# EAGLE design DPSD (EAGLE 9.6.2)
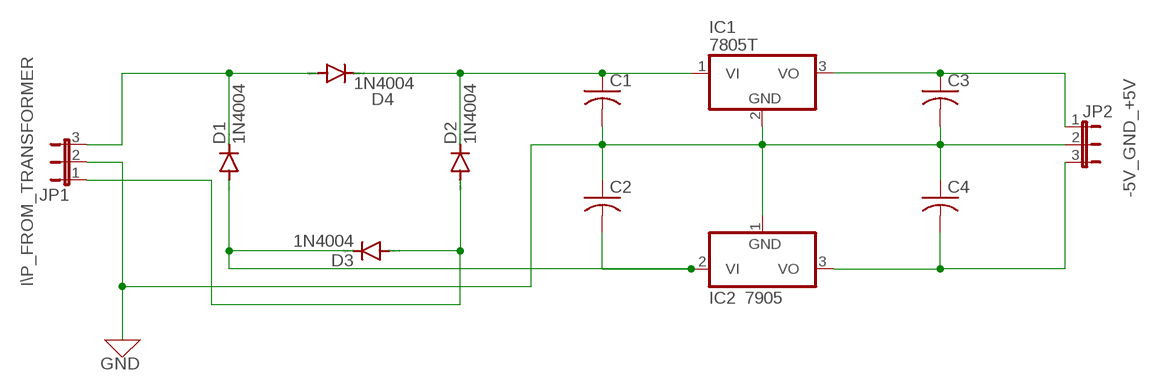
[diagram p0: schematic, sheet 1]

## Parts
C1  C-US025-024X044  [C025-024X044]
C2  C-US025-024X044  [C025-024X044]
C3  C-US025-024X044  [C025-024X044]
C4  C-US025-024X044  [C025-024X044]
D1  1N4004  [DO41-10]
D2  1N4004  [DO41-10]
D3  1N4004  [DO41-10]
D4  1N4004  [DO41-10]
IC1  7805T  [TO220H]
IC2  7905T  [TO220H]
JP1  JP2E  [JP2]
JP2  JP2E  [JP2]

## Nets
0: C1.2 C2.1 IC1.2(GND) IC2.1(GND) JP1.2 JP2.2 ; supply symbol labelled GND
N$1: D1.C D4.A JP1.3
N$2: C1.1 D2.C D4.C IC1.1(VI)
N$3: D2.A D3.A JP1.1
N$5: C3.2 C4.1
N$8: C3.1 IC1.3(VO) JP2.1
N$9: C4.2 IC2.3(VO) JP2.3
N$11: C2.2 D1.A D3.C IC2.2(VI)

## Notes on the sheet
- -5V_GND_+5V
- I\P_FROM_TRANSFORMER
- 7905
- GND

## Library data of the parts
C1-C4 = rcl:C-US: CAPACITOR, American symbol; SPICEPREFIX: C
D1-D4 = diode:1N4004: DIODE general purpose rectifier, 1 A
IC1 = linear:78*: Positive VOLTAGE REGULATOR Source: http://cache.national.com/ds/LM/LM78L05.pdf http://www.fairchildsemi.com/ds/LM/LM7805.pdf
IC2 = linear:79*: Negative VOLTAGE REGULATOR
JP1 JP2 = jumper:JP2E: JUMPER

## Board
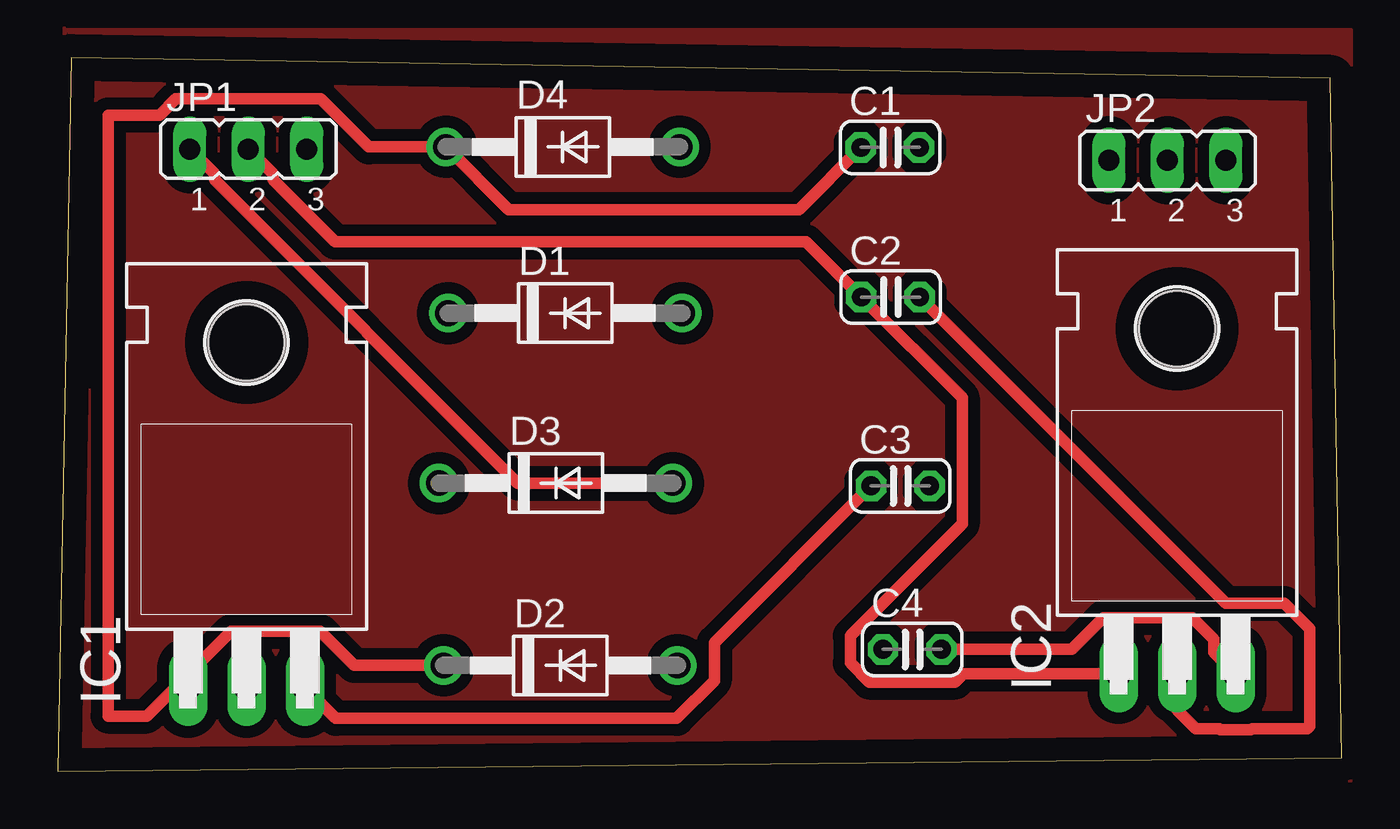
[diagram p1: board, top side]
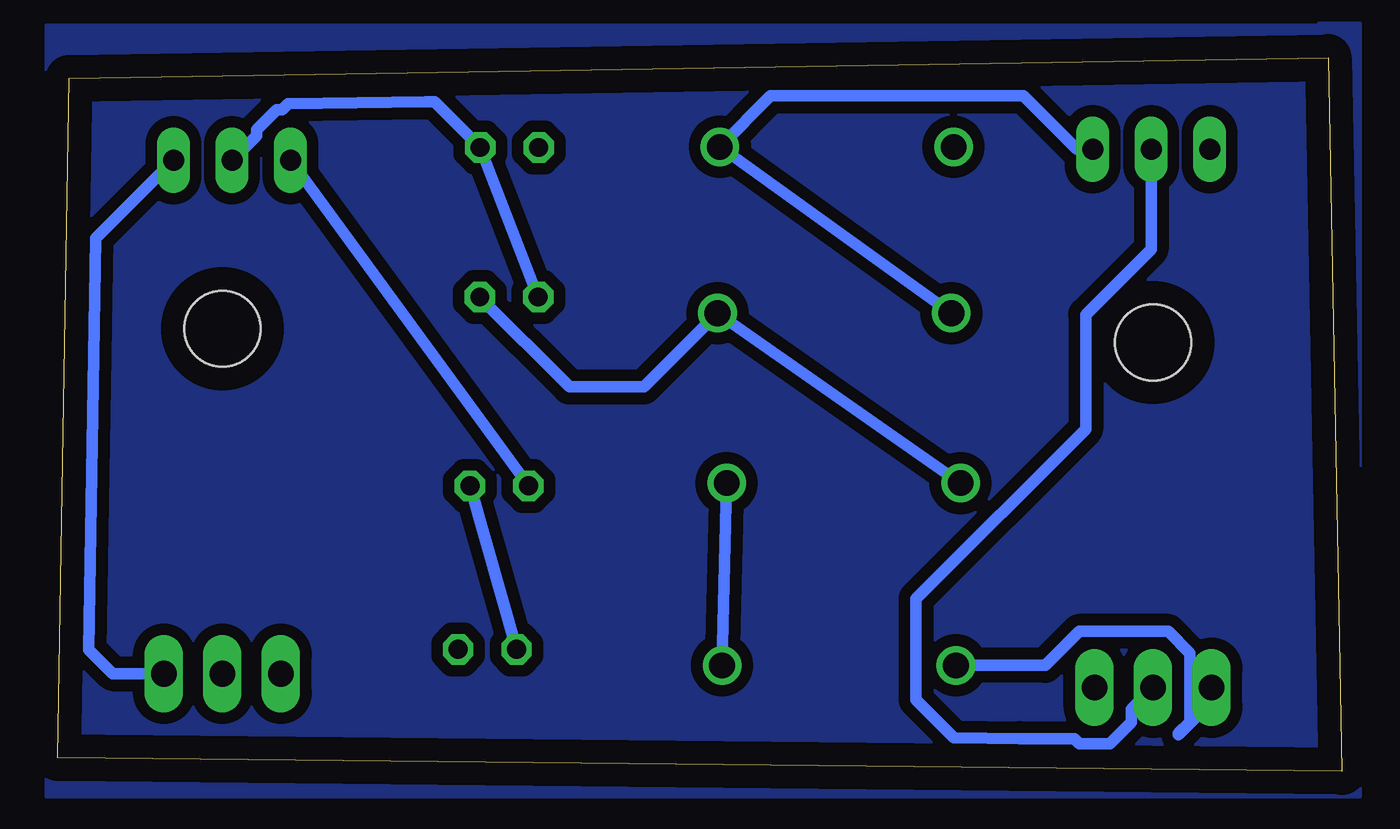
[diagram p2: board, bottom side, seen from below]

Size 55.8 x 31 mm. Coordinates in mm from the lower left corner, seen from the top.
Outline: 0,0 55.8,0.6 55.3,30.1 0.6,31 0,0
Copper layers (1*16): Top 0.035mm / dielectric 1.5mm / Bottom 0.035mm
Design rules "default *": minimum track width 6mil, minimum drill 0.35mm, track to track 20mil, track to pad 20mil, pad to pad 20mil, via to via 20mil, smd to smd 6mil, copper to edge 40mil, drill to drill 6mil, minimum pad ring 10mil, minimum via ring 8mil, stop-mask expansion 4mil, vias tented up to drill 0mil, thermal gap 10mil

### Footprints (pad centres in the part's own frame; a part is rotated, then mirrored left to right if it is on the bottom)
C025-024X044 = drill 0.813 octagon: 1 -1.27,0; 2 1.27,0
DO41-10 = drill 1.118: A 5.08,0; C -5.08,0
TO220H = drill 1.118 long: 1 -2.54,-10.16; 2 0,-10.16; 3 2.54,-10.16 | hole 3.302: 0,4.826
JP2 = drill 0.914 long: 1 -2.54,0; 2 0,0; 3 2.54,0

### Placement (x,y rotation side)
C1  36.17,27.1 0 top
C2  36.19,20.6 0 top
C3  36.61,12.4 0 top
C4  37.13,5.3 0 top
D1  22.05,19.9 0 top
D2  21.85,4.6 0 top
D3  21.65,12.52 0 top
D4  21.95,27.12 0 top
IC1  8.21,13.8 0 top
IC2  48.64,14.4 0 top
JP1  8.29,27.02 0 top
JP2  48.22,26.54 0 top

### Tracks (layer width: path | path; a pad name or v marks a point on that pad's centre or on a via)
0
  Top 0.508: JP1.2 9.36,25.95 9.36,25.7 12.05,23 32.52,23 C2.1 39.3,16.22 39.3,10.75 34.44,5.89 34.44,4.71 35.27,3.88 38.99,3.88 39.35,4.24 IC2.1
  Bottom 0.508: C2.1 C1.2 39.43,29.08 39.79,29.08 45.77,28.99 46.04,28.72 46.29,28.72 47.15,27.86 47.15,27.61 JP2.2 | JP1.2 8.29,22.68 11.13,19.84 11.13,14.87 18.5,7.5 18.5,3.1 16.85,1.45 14,1.42 11.63,1.42 11.41,1.2 10.09,1.2 9.15,2.14 9.15,2.7 IC1.2
GND
  pour Top: 0.4,32.2 56.2,32.2 56.2,-0.4 0.3,-0.4 0.3,32.3 0.3,32 0.5,32 0.5,32.2 0.3,32.2 0.3,32
  pour Bottom: 0,32.4 56.3,32.4 56.3,32 56.3,-1.1 55.9,-1.1 -0.8,-1.1 -0.8,-0.9 -0.8,32.5 0.5,32.5 1,32.5
N$1
  Bottom 0.508: D1.C D4.A 24.82,29.33 24.3,29.34 13.84,29.34 11.52,27.02 JP1.3
N$2
  Top 0.508: D2.C 12.89,4.6 11.41,6.08 7.55,6.08 3.87,2.4 2.2,2.4 2.2,28.5 4.44,28.5 5.14,29.2 11.44,29.2 13.53,27.12 D4.C 19.59,24.4 32.2,24.4 C1.1
  Bottom 0.508: IC1.1 5.67,3.03 7.1,1.6 7.1,1.65 6.61,2.14 6.61,5.14 7.55,6.08 11.41,6.08 12.89,4.6 D2.C
N$3
  Top 0.508: JP1.1 6.82,25.95 6.82,25.7 19.99,12.52 D3.A
  Bottom 0.508: D3.A D2.A
N$5
  Bottom 0.508: C3.2 C4.1
N$8
  Top 0.508: C3.1 28.53,5.59 28.53,3.94 26.89,2.3 12.09,2.3 IC1.3
  Bottom 0.508: JP2.1 C3.1
N$9
  Top 0.508: IC2.3 50.24,5.18 50.24,5.74 49.3,6.68 45.44,6.68 44.06,5.3 C4.2
  Bottom 0.508: JP2.3 54.15,23.15 54.45,5.29 53.4,4.24 IC2.3
N$11
  Top 0.508: C2.2 50.76,7.3 53.3,7.3 54.4,6.2 54.4,1.96 54.3,1.85 51.9,1.85 51.84,1.8 50.52,1.8 50.47,1.85 49.45,1.85 48.64,2.66 IC2.2
  Bottom 0.508: D3.C D1.A 30.33,16.7 33.56,16.7 C2.2